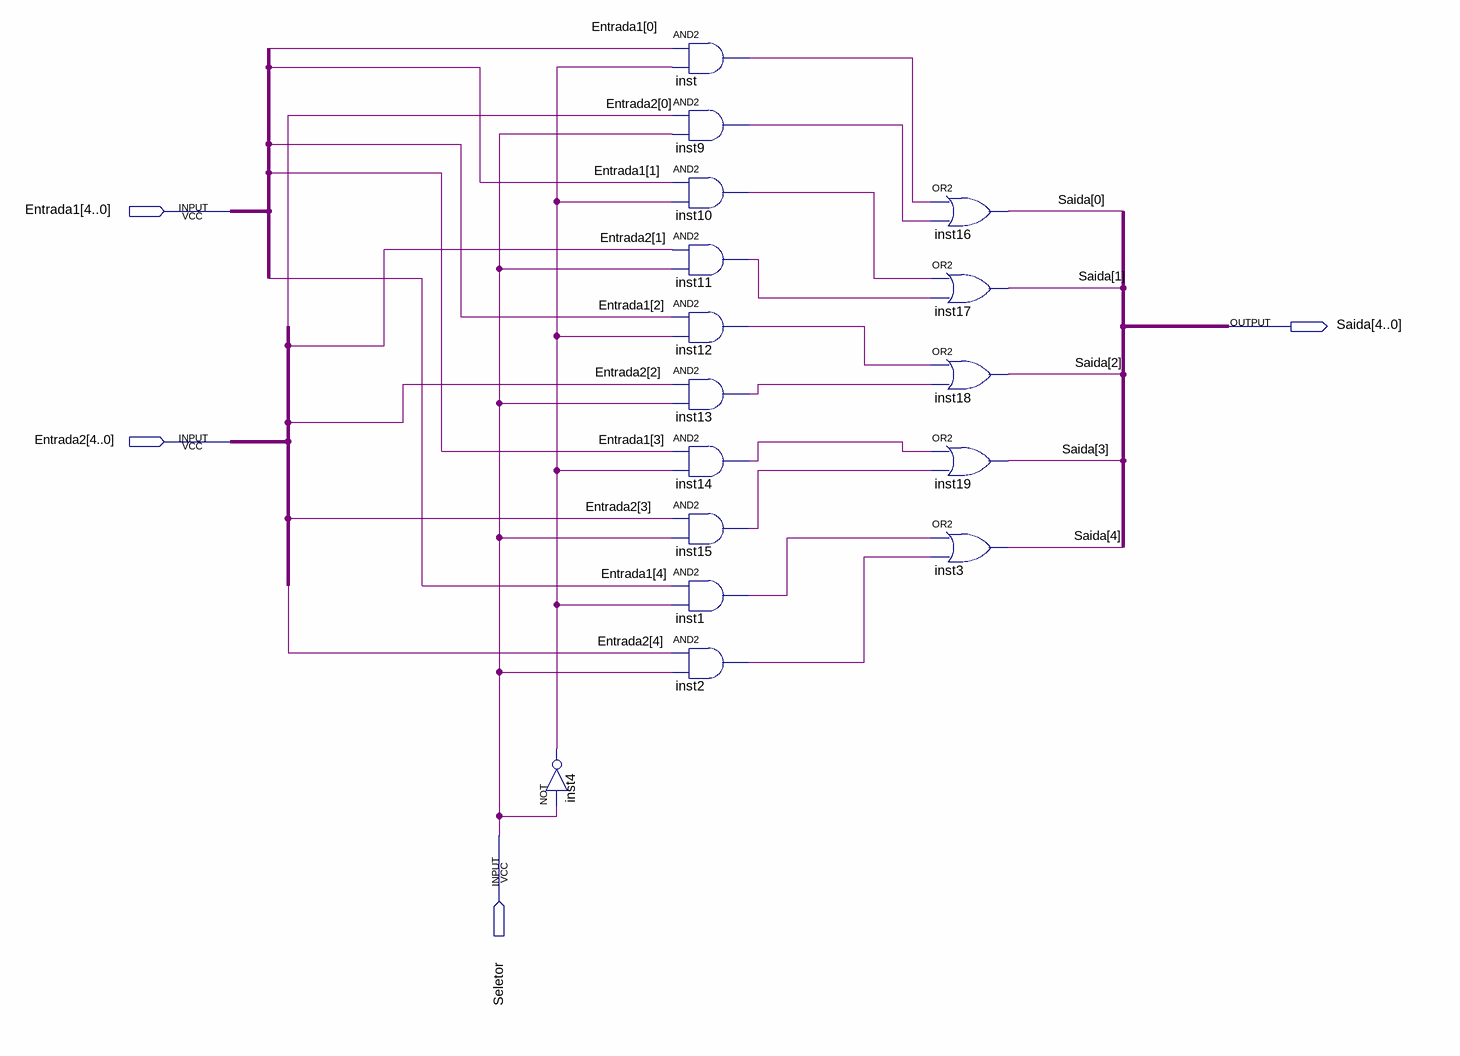
[diagram p0: schematic sheet]
// Quartus schematic MUX_5bits.bdf as structural Verilog: 16 symbols, 4 pins
module MUX_5bits (
  input  [4:0] Entrada1,
  input  [4:0] Entrada2,
  input  Seletor,
  output [4:0] Saida
);

  wire inst1_out, inst2_out, inst4_out, inst9_out, inst10_out, inst11_out, inst12_out, inst13_out,
       inst14_out, inst15_out, inst_out;

  not inst4 (inst4_out, Seletor);
  and inst (inst_out, Entrada1[0], inst4_out);
  and inst9 (inst9_out, Entrada2[0], Seletor);
  and inst10 (inst10_out, Entrada1[1], inst4_out);
  and inst11 (inst11_out, Entrada2[1], Seletor);
  and inst12 (inst12_out, Entrada1[2], inst4_out);
  and inst13 (inst13_out, Entrada2[2], Seletor);
  and inst14 (inst14_out, Entrada1[3], inst4_out);
  and inst15 (inst15_out, Entrada2[3], Seletor);
  and inst1 (inst1_out, Entrada1[4], inst4_out);
  and inst2 (inst2_out, Entrada2[4], Seletor);
  or inst16 (Saida[0], inst_out, inst9_out);
  or inst17 (Saida[1], inst10_out, inst11_out);
  or inst18 (Saida[2], inst12_out, inst13_out);
  or inst19 (Saida[3], inst14_out, inst15_out);
  or inst3 (Saida[4], inst1_out, inst2_out);
endmodule
